# EAGLE design Pi Hat (EAGLE 9.5.2)

## Sheet 1 of 3: Pi
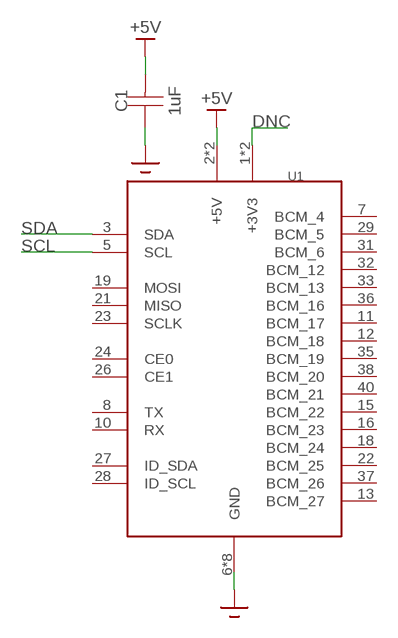
[diagram p0: schematic, sheet 1]

### Parts
C1  1uF  CAPACITOR0805  [0805]
U1  RPI  [RPI]

### Nets
+5V: C1.P$2 U1.2(+5V) U1.4(+5V) ; also sheet 2
DNC: U1.1(+3V3) U1.17(+3V3)
GND: C1.P$1 U1.6(GND) U1.9(GND) U1.14(GND) U1.20(GND) U1.25(GND) U1.30(GND) U1.34(GND) U1.39(GND) ; also sheet 2,3
SCL: U1.5(SCL) ; also sheet 3
SDA: U1.3(SDA) ; also sheet 3
Unconnected: U1.7(BCM_4) U1.8(TX) U1.10(RX) U1.11(BCM_17) U1.12(BCM_18) U1.13(BCM_27) U1.15(BCM_22) U1.16(BCM_23) U1.18(BCM_24) U1.19(MOSI) U1.21(MISO) U1.22(BCM_25) U1.23(SCLK) U1.24(CE0) U1.26(CE1) U1.27(ID_SDA) U1.28(ID_SCL) U1.29(BCM_5) U1.31(BCM_6) U1.32(BCM_12) U1.33(BCM_13) U1.35(BCM_19) U1.36(BCM_16) U1.37(BCM_26) U1.38(BCM_20) U1.40(BCM_21)

## Sheet 2 of 3: Power
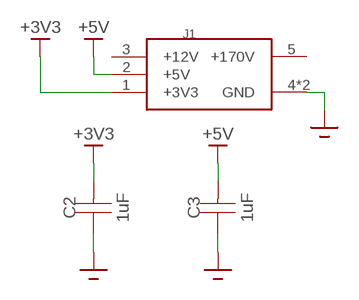
[diagram p1: schematic, sheet 2]

### Parts
C2  1uF  CAPACITOR0805  [0805]
C3  1uF  CAPACITOR0805  [0805]
J1  1-770969-0  [1-770969-0]

### Nets
+3V3: C2.P$2 J1.1(+3V3) ; also sheet 3
+5V: C3.P$2 J1.2(+5V) ; also sheet 1
GND: C2.P$1 C3.P$1 J1.4(GND) J1.6(GND) ; also sheet 1,3

## Sheet 3 of 3: I2C
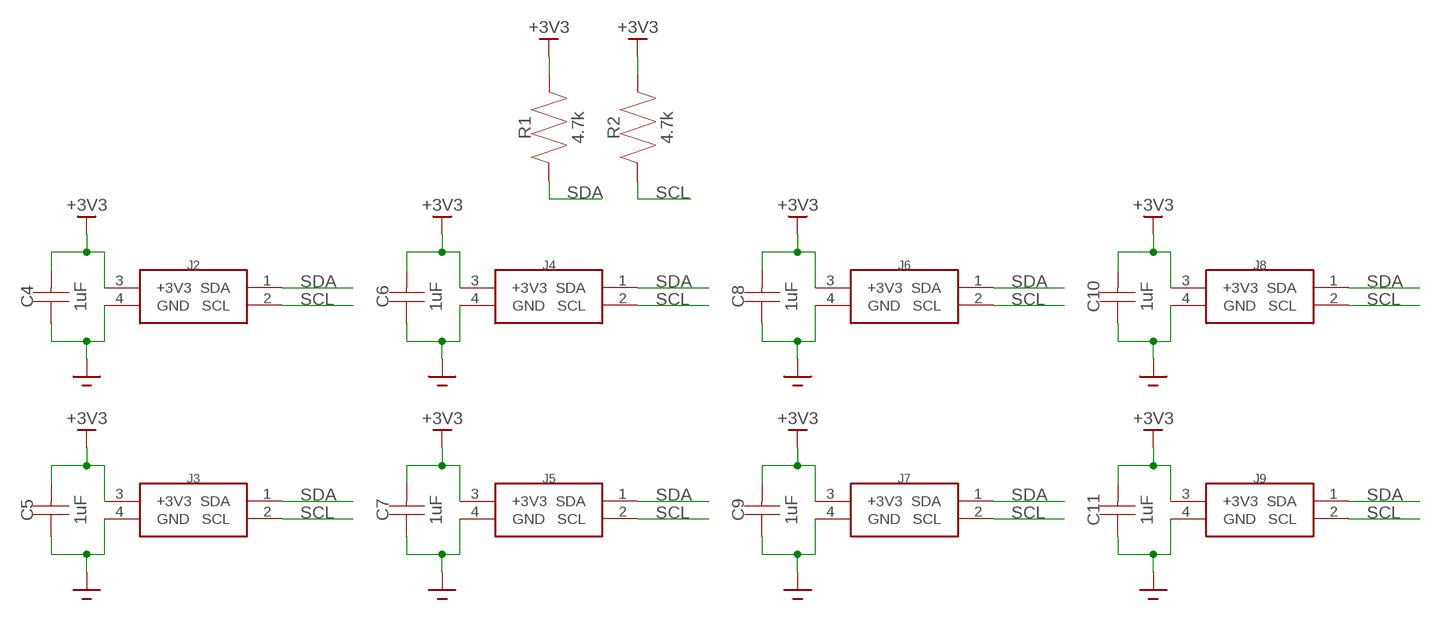
[diagram p2: schematic, sheet 3]

### Parts
C4  1uF  CAPACITOR0805  [0805]
C5  1uF  CAPACITOR0805  [0805]
C6  1uF  CAPACITOR0805  [0805]
C7  1uF  CAPACITOR0805  [0805]
C8  1uF  CAPACITOR0805  [0805]
C9  1uF  CAPACITOR0805  [0805]
C10  1uF  CAPACITOR0805  [0805]
C11  1uF  CAPACITOR0805  [0805]
J2  1-770968-0  [1-770968-0]
J3  1-770968-0  [1-770968-0]
J4  1-770968-0  [1-770968-0]
J5  1-770968-0  [1-770968-0]
J6  1-770968-0  [1-770968-0]
J7  1-770968-0  [1-770968-0]
J8  1-770968-0  [1-770968-0]
J9  1-770968-0  [1-770968-0]
R1  4.7k  RESISTOR0805  [0805]
R2  4.7k  RESISTOR0805  [0805]

### Nets
+3V3: C4.P$2 C5.P$2 C6.P$2 C7.P$2 C8.P$2 C9.P$2 C10.P$2 C11.P$2 J2.3(+3V3) J3.3(+3V3) J4.3(+3V3) J5.3(+3V3) J6.3(+3V3) J7.3(+3V3) J8.3(+3V3) J9.3(+3V3) R1.P$2 R2.P$2 ; also sheet 2
GND: C4.P$1 C5.P$1 C6.P$1 C7.P$1 C8.P$1 C9.P$1 C10.P$1 C11.P$1 J2.4(GND) J3.4(GND) J4.4(GND) J5.4(GND) J6.4(GND) J7.4(GND) J8.4(GND) J9.4(GND) ; also sheet 1,2
SCL: J2.2(SCL) J3.2(SCL) J4.2(SCL) J5.2(SCL) J6.2(SCL) J7.2(SCL) J8.2(SCL) J9.2(SCL) R2.P$1 ; also sheet 1
SDA: J2.1(SDA) J3.1(SDA) J4.1(SDA) J5.1(SDA) J6.1(SDA) J7.1(SDA) J8.1(SDA) J9.1(SDA) R1.P$1 ; also sheet 1

## Power pins joined to a net without a drawn wire
+12V: J1.3(+12V)
+170V: J1.5(+170V)

## Library data of the parts
C1-C11 = Zach:CAPACITOR
J1 = Zach:1-770969-0
J2-J9 = Zach:1-770968-0
R1 R2 = Zach:RESISTOR
U1 = Zach:RPI

## Board
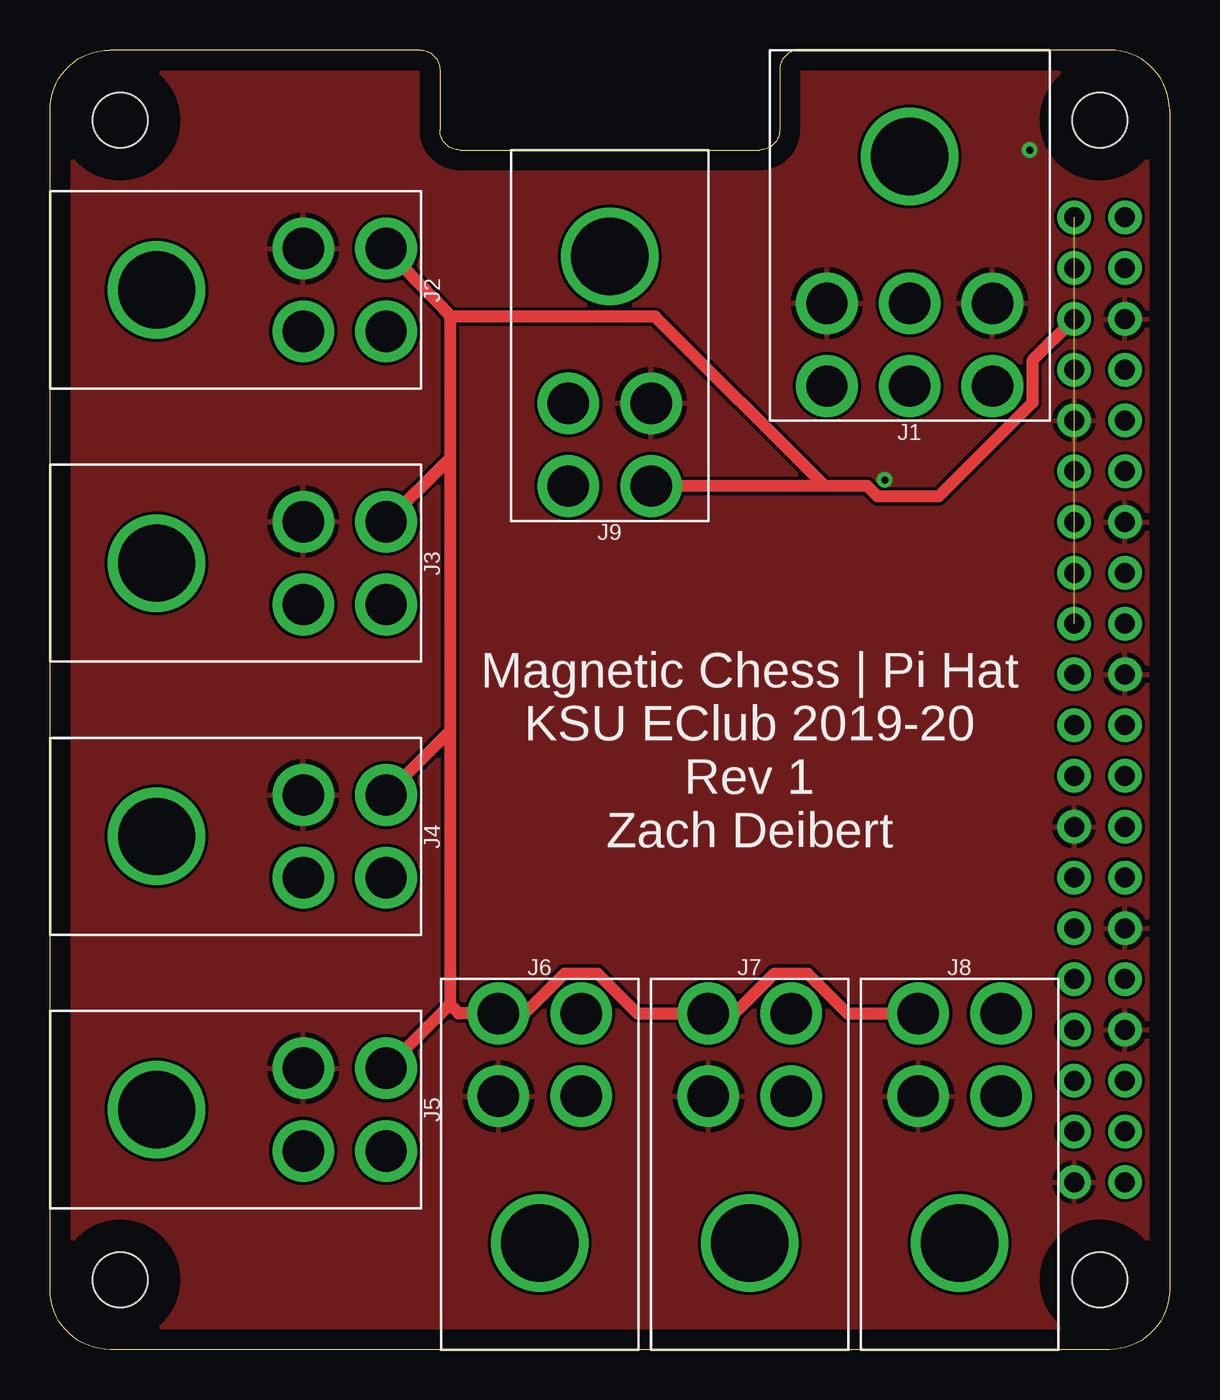
[diagram p3: board, top side]
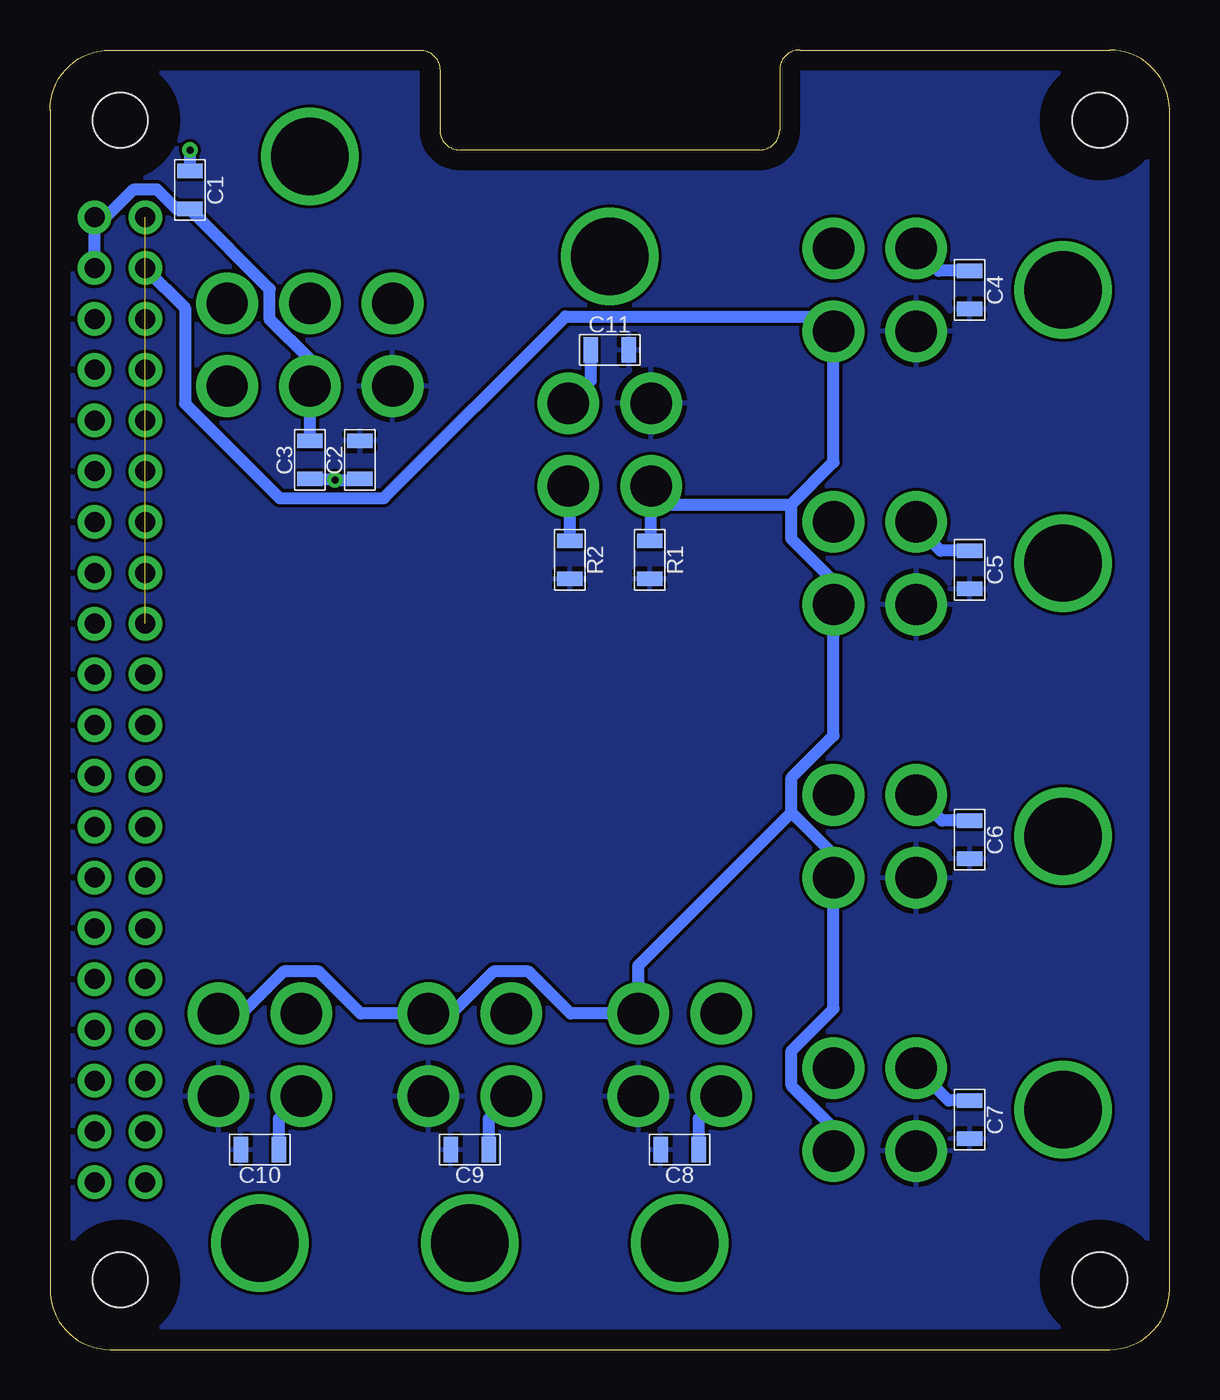
[diagram p4: board, bottom side, seen from below]

Size 56 x 65 mm. Coordinates in mm from the lower left corner, seen from the top.
Copper layers (1*16): Top 0.035mm / dielectric 1.5mm / Bottom 0.035mm
Design rules "default": minimum track width 6mil, minimum drill 0.35mm, track to track 6mil, track to pad 6mil, pad to pad 6mil, via to via 6mil, smd to smd 6mil, copper to edge 40mil, drill to drill 6mil, minimum pad ring 10mil, minimum via ring 8mil, stop-mask expansion 4mil, vias tented up to drill 0mil, thermal gap 10mil

### Footprints (pad centres in the part's own frame; a part is rotated, then mirrored left to right if it is on the bottom)
0805 = smd 0.711 x 1.295: P$1 -0.953,0; P$2 0.953,0
1-770969-0 = drill 2.07: 1 4.14,16.81; 2 0,16.81; 3 -4.14,16.81; 4 4.14,12.67; 5 0,12.67; 6 -4.14,12.67 | drill 3.86: 7 0,5.33
1-770968-0 = drill 2.07: 1 2.07,16.81; 2 -2.07,16.81; 3 2.07,12.67; 4 -2.07,12.67 | drill 3.86: 5 0,5.33
RPI = drill 1 pad 1.676: 1 -1.27,24.13; 2 1.27,24.13; 3 -1.27,21.59; 4 1.27,21.59; 5 -1.27,19.05; 6 1.27,19.05; 7 -1.27,16.51; 8 1.27,16.51; 9 -1.27,13.97; 10 1.27,13.97; 11 -1.27,11.43; 12 1.27,11.43; 13 -1.27,8.89; 14 1.27,8.89; 15 -1.27,6.35; 16 1.27,6.35; 17 -1.27,3.81; 18 1.27,3.81; 19 -1.27,1.27; 20 1.27,1.27; 21 -1.27,-1.27; 22 1.27,-1.27; 23 -1.27,-3.81; 24 1.27,-3.81; 25 -1.27,-6.35; 26 1.27,-6.35; 27 -1.27,-8.89; 28 1.27,-8.89; 29 -1.27,-11.43; 30 1.27,-11.43; 31 -1.27,-13.97; 32 1.27,-13.97; 33 -1.27,-16.51; 34 1.27,-16.51; 35 -1.27,-19.05; 36 1.27,-19.05; 37 -1.27,-21.59; 38 1.27,-21.59; 39 -1.27,-24.13; 40 1.27,-24.13 | hole 2.75: 0,29; 0,-29; -49,29; -49,-29

### Placement (x,y rotation side)
C1  49,58 270 bottom
C2  40.5,44.5 90 bottom
C3  43,44.5 90 bottom
C4  10,53 270 bottom
C5  10,39 270 bottom
C6  10,25.5 270 bottom
C7  10,11.5 270 bottom
C8  24.5,10 180 bottom
C9  35,10 180 bottom
C10  45.5,10 180 bottom
C11  28,50 0 bottom
J1  43,65 180 top
J2  0,53 270 top
J3  0,39.33 270 top
J4  0,25.67 270 top
J5  0,12 270 top
J6  24.5,0 0 top
J7  35,0 0 top
J8  45.5,0 0 top
J9  28,60 180 top
R1  26,39.5 270 bottom
R2  30,39.5 270 bottom
U1  52.5,32.5 0 top

### Tracks (layer width: path | path; a pad name or v marks a point on that pad's centre or on a via)
+3V3
  pour Bottom: 0,0 0,65 28.5,65 56,65 56,12.5 56,0
+5V
  Bottom 0.61: U1.4 U1.2 53.21,56.63 51.81,58.03 50.65,58.03 49.67,57.05 C1.P$2 45,53.05 45,51.5 43,49.5 J1.2 C3.P$2
DNC  (1 unrouted)
GND  (via drill 0.35)
  Bottom 0.61: C4.P$1 11.55,53.95 J2.4 | C11.P$1 28.95,48.45 J9.4 | C5.P$1 11.45,39.95 12.67,41.17 J3.4 | C6.P$1 11.39,26.45 J4.4 | C7.P$1 11.05,12.45 J5.4 | C8.P$1 23.55,11.55 J6.4 | C9.P$1 34.05,11.55 J7.4 | C10.P$1 44.55,11.55 J8.4 | C1.P$1 v49,60 | C3.P$1 41.8,43.55 v41.75,43.5 40.55,43.5 C2.P$1
  pour Top: 0,0 0,65 48.5,65 56,65 56,10 56,0
SCL
  Top 0.61: U1.5 49.14,49.46 49.14,47.36 44.44,42.66 41.4,42.66 40.88,43.19 38.75,43.19 | 38.75,43.19 J9.2 | J2.2 16.81,55.02 20.05,51.67 | 38.75,43.19 30.27,51.67 20.05,51.67 | 20.05,51.67 20,51.62 20,44.59 | J3.2 20,44.59 | 20,44.59 20,30.93 | 20,30.93 J4.2 | 20,30.93 20,17.26 | 20,17.26 J5.2 | 20,17.26 20.45,16.81 J6.2 23.74,16.81 25.74,18.81 27.4,18.81 29.4,16.81 J7.2 34.24,16.81 36.24,18.81 37.9,18.81 39.9,16.81 J8.2
  Bottom 0.61: R2.P$1 30,43.12 J9.2
SDA
  Bottom 0.61: R1.P$1 25.93,40.52 J9.1 25.01,42.27 18.91,42.27 | 18.91,42.27 18.91,40.53 16.81,38.43 J3.1 16.81,30.71 18.91,28.61 18.91,26.87 | 18.91,42.27 16.81,44.38 J2.1 17.55,51.67 30.22,51.67 39.31,42.58 44.51,42.58 49.24,47.32 49.24,52.1 U1.3 | 18.91,26.87 16.81,24.76 J4.1 16.81,17.04 18.91,14.94 18.91,13.2 16.81,11.1 J5.1 | 18.91,26.87 26.57,19.21 J6.1 29.96,16.81 32.06,18.91 33.8,18.91 35.9,16.81 J7.1 40.46,16.81 42.56,18.91 44.3,18.91 46.4,16.81 J8.1

### Text on the board
tPlace: Magnetic Chess | Pi Hat / KSU EClub 2019-20 / Rev 1 / Zach Deibert